# EAGLE schematic Garbage (EAGLE 7.7.0)
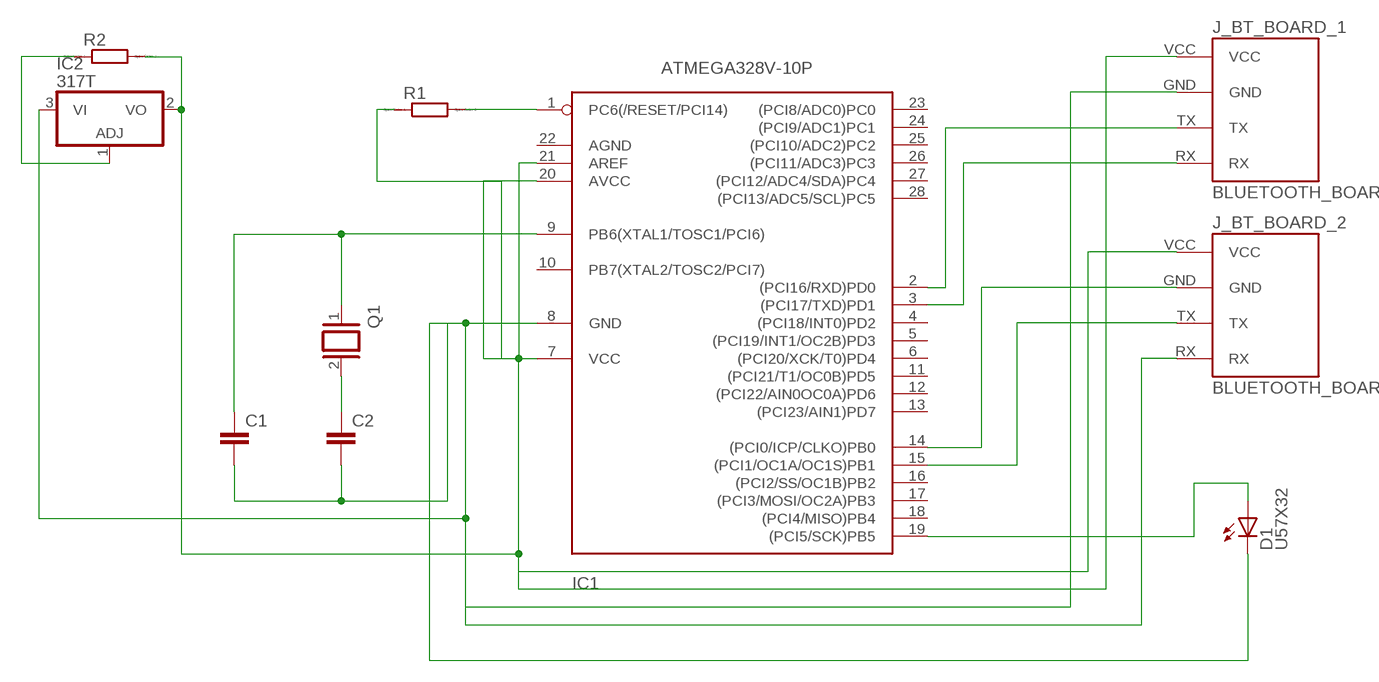
[diagram p0: schematic, sheet 1]

## Parts
C1  C2,5-3  [C2.5-3]
C2  C2,5-3  [C2.5-3]
D1  U57X32  [U57X32]
IC1  ATMEGA328V-10P  [DIL28-3]
IC2  317T  [TO220H]
J_BT_BOARD_1  BLUETOOTH_BOARD  [BT_BOARD_FOOTPRINT]
J_BT_BOARD_2  BLUETOOTH_BOARD  [BT_BOARD_FOOTPRINT]
Q1  XTAL/S  [QS]
R1  R0204/7  [0204/7]
R2  R0204/7  [0204/7]

## Nets
N$1: C1.1 IC1.9(PB6(XTAL1/TOSC1/PCI6)) Q1.1
N$2: C2.1 Q1.2
N$3: D1.A IC1.19((PCI5/SCK)PB5)
N$4: IC2.1(ADJ) R2.1
N$5: IC1.2((PCI16/RXD)PD0) J_BT_BOARD_1.TX
N$6: IC1.1(PC6(/RESET/PCI14)) R1.2
N$7: IC1.7(VCC) IC1.20(AVCC) IC1.21(AREF) IC2.2(VO) J_BT_BOARD_1.VCC J_BT_BOARD_2.VCC R1.1 R2.2
N$8: IC1.3((PCI17/TXD)PD1) J_BT_BOARD_1.RX
N$9: C1.2 C2.2 D1.K(C) IC1.8(GND) IC2.3(VI) J_BT_BOARD_1.GND J_BT_BOARD_2.RX
N$12: IC1.14((PCI0/ICP/CLKO)PB0) J_BT_BOARD_2.GND
N$13: IC1.15((PCI1/OC1A/OC1S)PB1) J_BT_BOARD_2.TX
Unconnected: IC1.4((PCI18/INT0)PD2) IC1.5((PCI19/INT1/OC2B)PD3) IC1.6((PCI20/XCK/T0)PD4) IC1.10(PB7(XTAL2/TOSC2/PCI7)) IC1.11((PCI21/T1/OC0B)PD5) IC1.12((PCI22/AIN0OC0A)PD6) IC1.13((PCI23/AIN1)PD7) IC1.16((PCI2/SS/OC1B)PB2) IC1.17((PCI3/MOSI/OC2A)PB3) IC1.18((PCI4/MISO)PB4) IC1.22(AGND) IC1.23((PCI8/ADC0)PC0) IC1.24((PCI9/ADC1)PC1) IC1.25((PCI10/ADC2)PC2) IC1.26((PCI11/ADC3)PC3) IC1.27((PCI12/ADC4/SDA)PC4) IC1.28((PCI13/ADC5/SCL)PC5)

## Library data of the parts
C1 C2 = capacitor-wima:C: CAPACITOR naming: grid - package width
D1 = led:U57X32: LED rectangle, 5.7 x 3.2 mm
IC1 = atmega328:ATMEGA328*P: MICROCONTROLLER 32 kBytes FLASH 2 kBytes SRAM 1 kBytes EEPROM USART 8-channel 10 bit ADC
IC2 = linear:*317: Positive VOLTAGE REGULATOR
J_BT_BOARD_1 J_BT_BOARD_2 = Bluetooth HC-05:BLUETOOTH_BOARD: Bluetooth Board V1.05
Q1 = special:XTAL/S: CRYSTAL
R1 R2 = eagle-ltspice:R: RESISTOR, European symbol; SPICEMODEL: NONE; SPICEPREFIX: R